# EAGLE schematic CMOSArray (EAGLE 9.3.2)
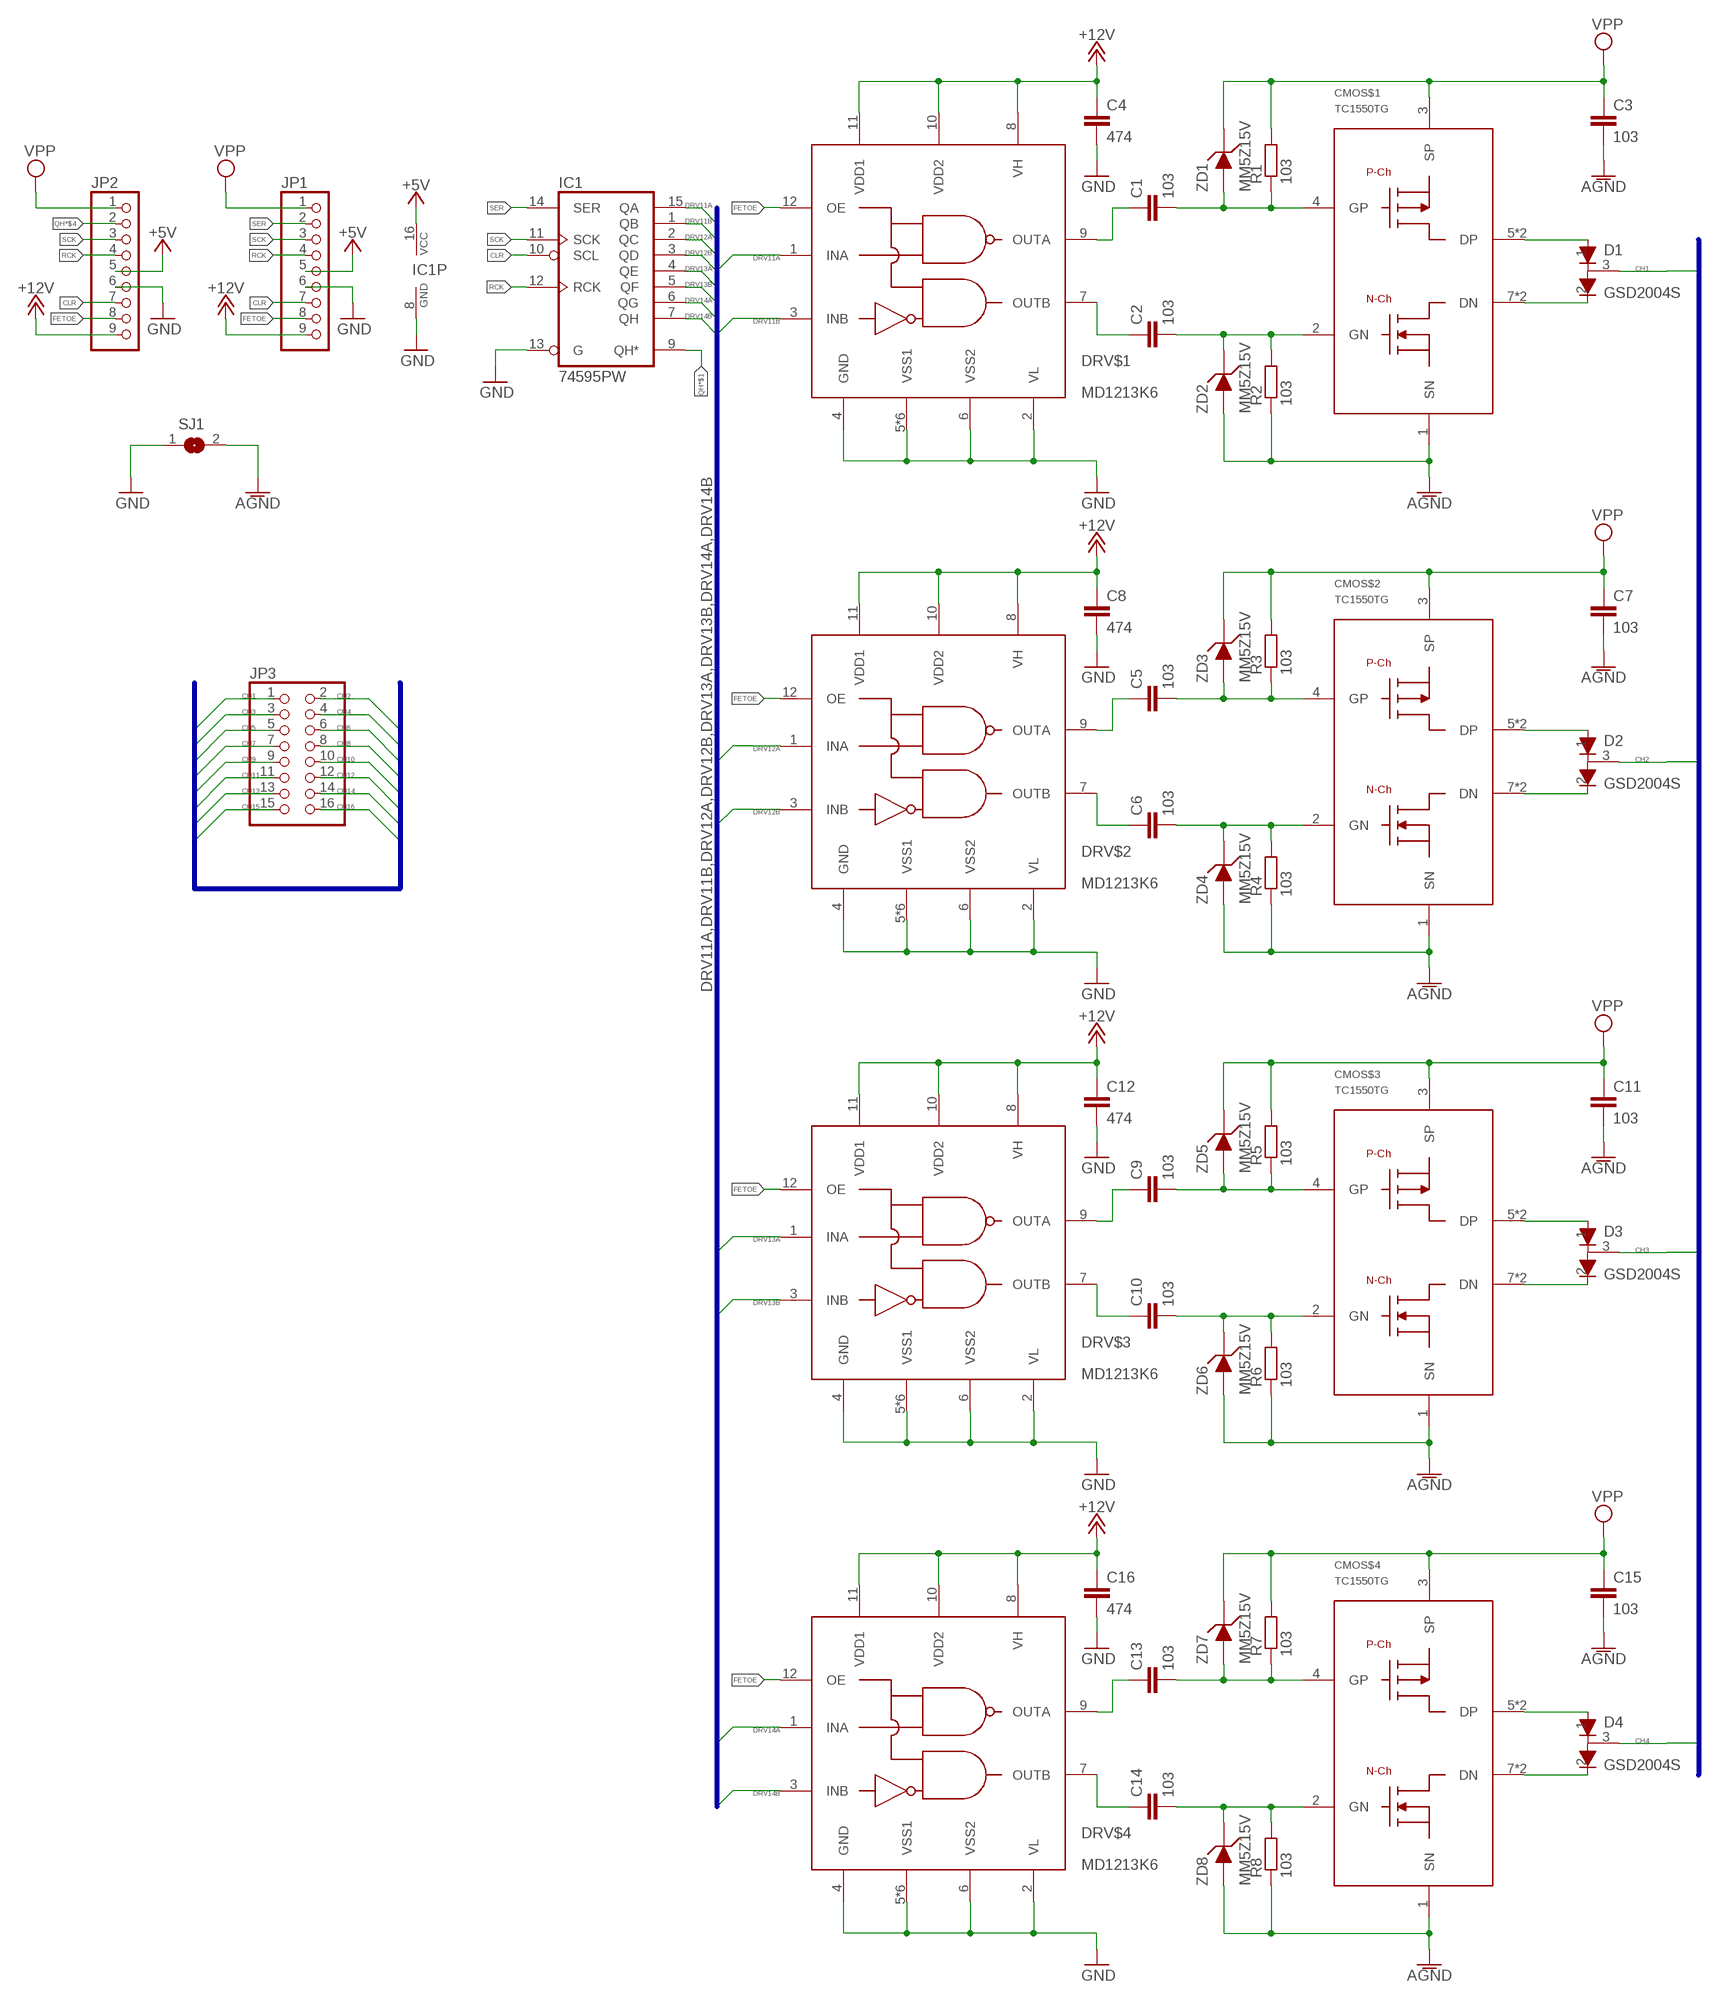
[diagram p0: schematic, sheet 1, part 1 of 3]
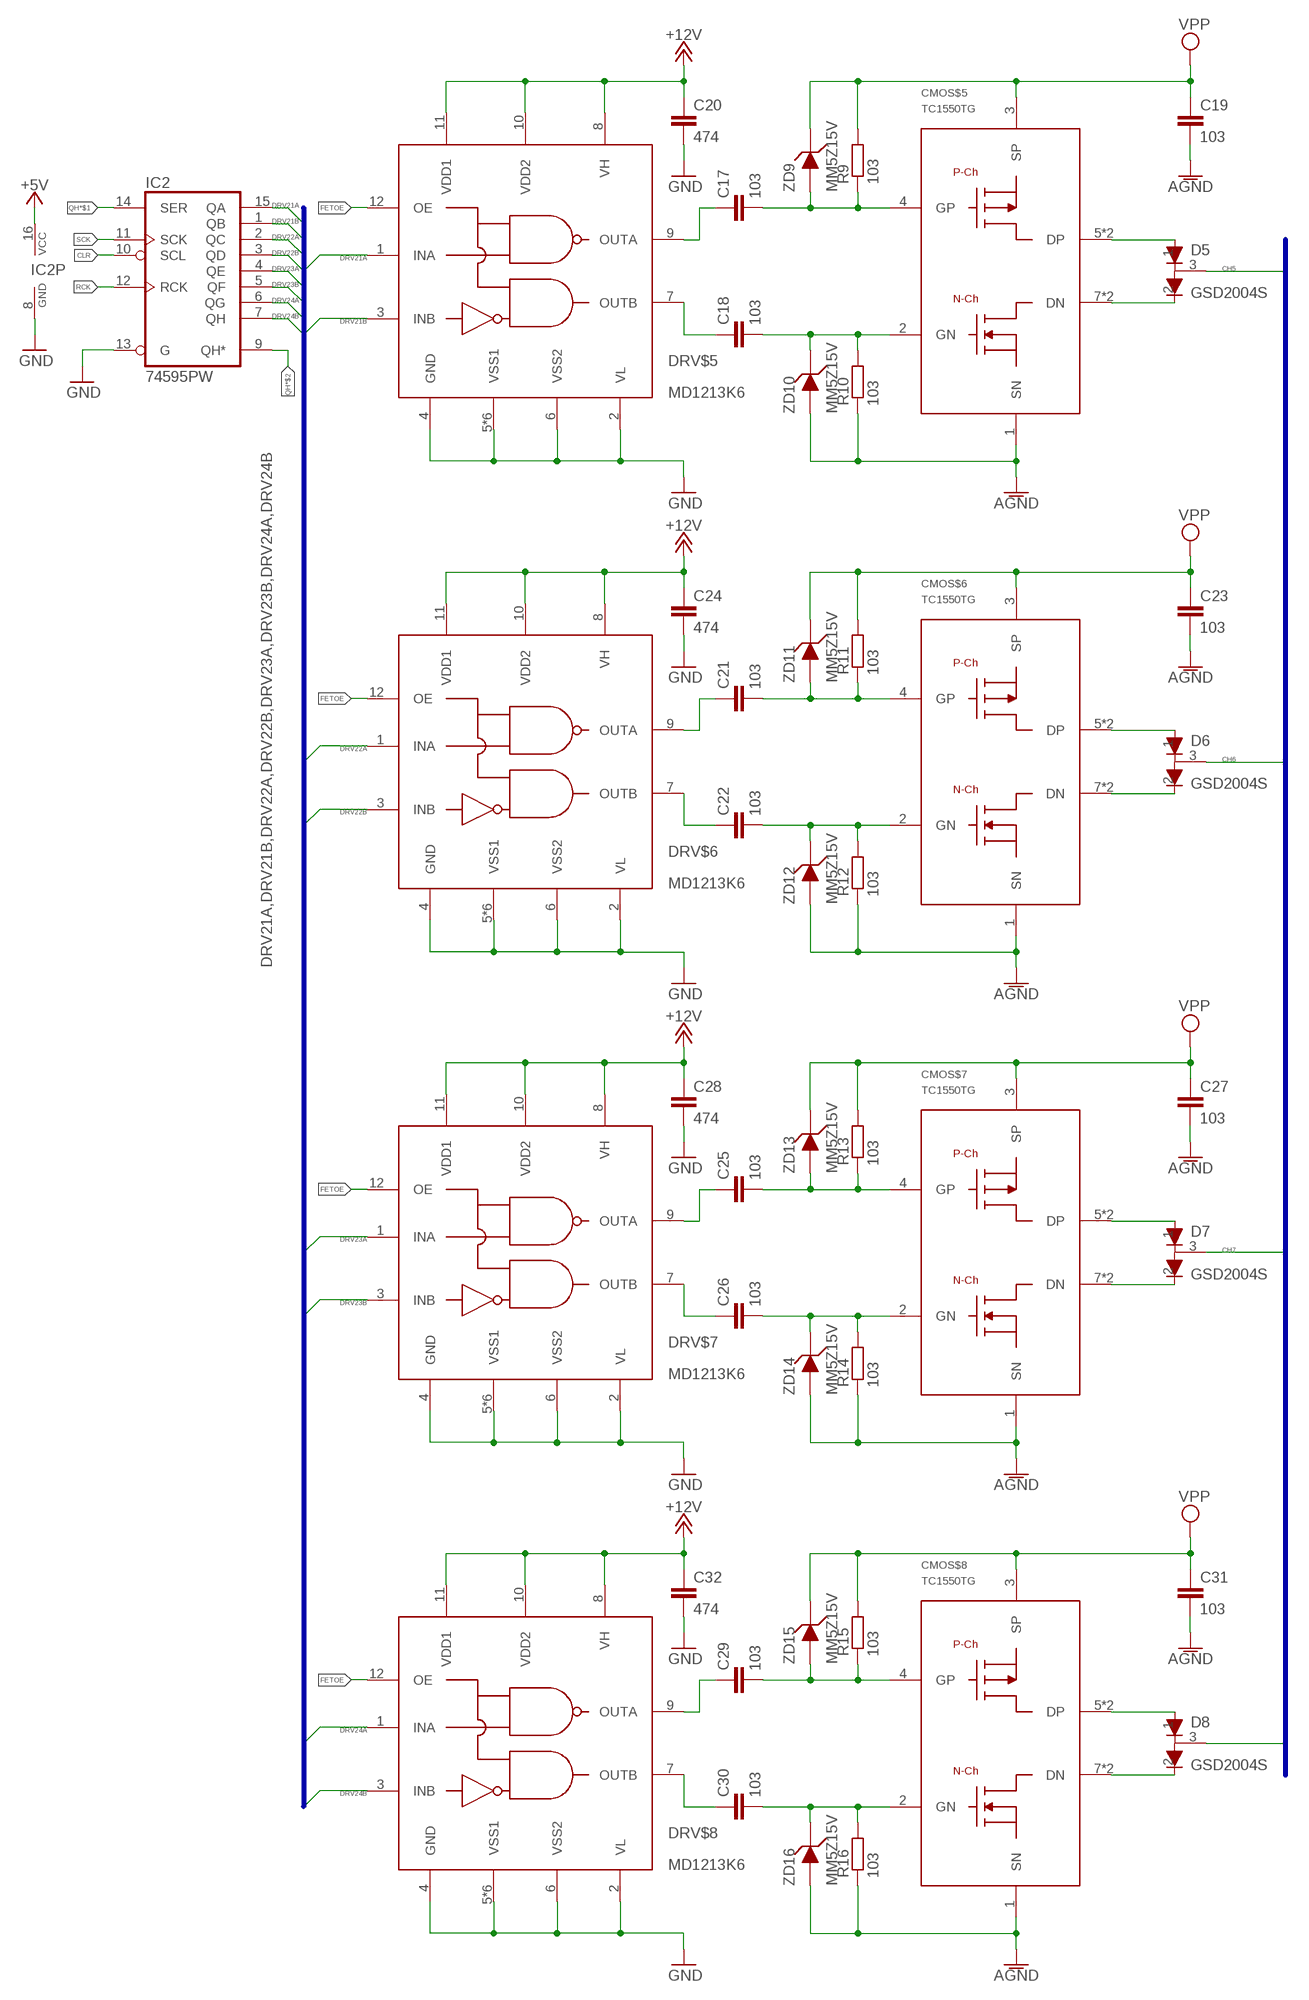
[diagram p1: schematic, sheet 1, part 2 of 3]
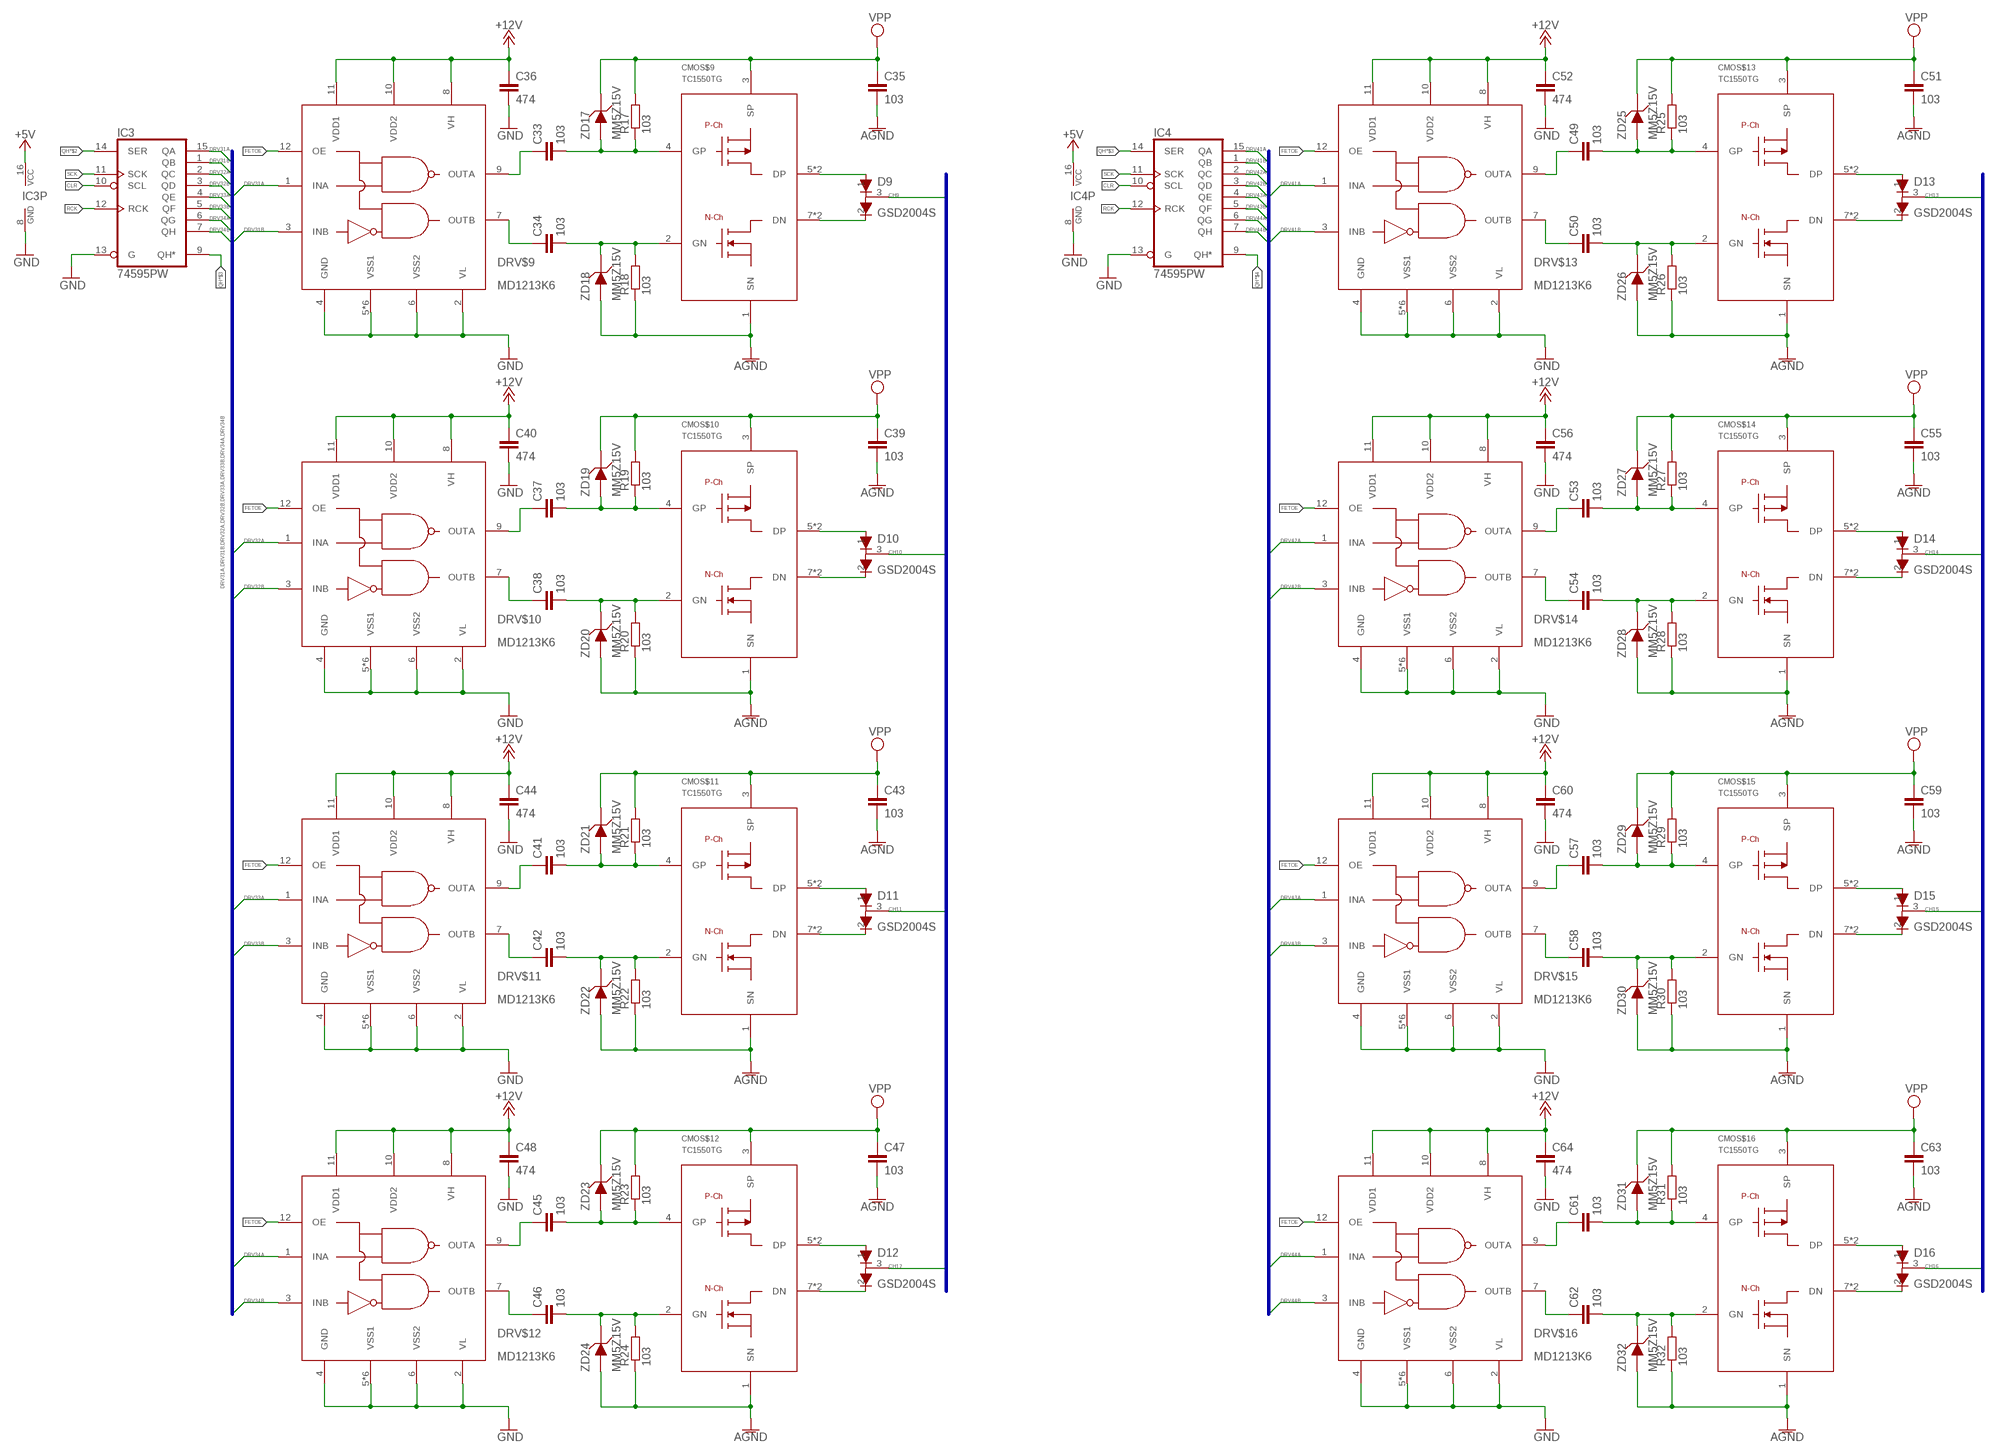
[diagram p2: schematic, sheet 1, part 3 of 3]

## Parts
C1  103  C-EUC3216  [C3216]
C2  103  C-EUC3216  [C3216]
C3  103  C-EUC3216  [C3216]
C4  474  C-EUC0402  [C0402]
C5  103  C-EUC3216  [C3216]
C6  103  C-EUC3216  [C3216]
C7  103  C-EUC3216  [C3216]
C8  474  C-EUC0402  [C0402]
C9  103  C-EUC3216  [C3216]
C10  103  C-EUC3216  [C3216]
C11  103  C-EUC3216  [C3216]
C12  474  C-EUC0402  [C0402]
C13  103  C-EUC3216  [C3216]
C14  103  C-EUC3216  [C3216]
C15  103  C-EUC3216  [C3216]
C16  474  C-EUC0402  [C0402]
C17  103  C-EUC3216  [C3216]
C18  103  C-EUC3216  [C3216]
C19  103  C-EUC3216  [C3216]
C20  474  C-EUC0402  [C0402]
C21  103  C-EUC3216  [C3216]
C22  103  C-EUC3216  [C3216]
C23  103  C-EUC3216  [C3216]
C24  474  C-EUC0402  [C0402]
C25  103  C-EUC3216  [C3216]
C26  103  C-EUC3216  [C3216]
C27  103  C-EUC3216  [C3216]
C28  474  C-EUC0402  [C0402]
C29  103  C-EUC3216  [C3216]
C30  103  C-EUC3216  [C3216]
C31  103  C-EUC3216  [C3216]
C32  474  C-EUC0402  [C0402]
C33  103  C-EUC3216  [C3216]
C34  103  C-EUC3216  [C3216]
C35  103  C-EUC3216  [C3216]
C36  474  C-EUC0402  [C0402]
C37  103  C-EUC3216  [C3216]
C38  103  C-EUC3216  [C3216]
C39  103  C-EUC3216  [C3216]
C40  474  C-EUC0402  [C0402]
C41  103  C-EUC3216  [C3216]
C42  103  C-EUC3216  [C3216]
C43  103  C-EUC3216  [C3216]
C44  474  C-EUC0402  [C0402]
C45  103  C-EUC3216  [C3216]
C46  103  C-EUC3216  [C3216]
C47  103  C-EUC3216  [C3216]
C48  474  C-EUC0402  [C0402]
C49  103  C-EUC3216  [C3216]
C50  103  C-EUC3216  [C3216]
C51  103  C-EUC3216  [C3216]
C52  474  C-EUC0402  [C0402]
C53  103  C-EUC3216  [C3216]
C54  103  C-EUC3216  [C3216]
C55  103  C-EUC3216  [C3216]
C56  474  C-EUC0402  [C0402]
C57  103  C-EUC3216  [C3216]
C58  103  C-EUC3216  [C3216]
C59  103  C-EUC3216  [C3216]
C60  474  C-EUC0402  [C0402]
C61  103  C-EUC3216  [C3216]
C62  103  C-EUC3216  [C3216]
C63  103  C-EUC3216  [C3216]
C64  474  C-EUC0402  [C0402]
CMOS$1  TC1550TG  [SOIC-08LG]
CMOS$2  TC1550TG  [SOIC-08LG]
CMOS$3  TC1550TG  [SOIC-08LG]
CMOS$4  TC1550TG  [SOIC-08LG]
CMOS$5  TC1550TG  [SOIC-08LG]
CMOS$6  TC1550TG  [SOIC-08LG]
CMOS$7  TC1550TG  [SOIC-08LG]
CMOS$8  TC1550TG  [SOIC-08LG]
CMOS$9  TC1550TG  [SOIC-08LG]
CMOS$10  TC1550TG  [SOIC-08LG]
CMOS$11  TC1550TG  [SOIC-08LG]
CMOS$12  TC1550TG  [SOIC-08LG]
CMOS$13  TC1550TG  [SOIC-08LG]
CMOS$14  TC1550TG  [SOIC-08LG]
CMOS$15  TC1550TG  [SOIC-08LG]
CMOS$16  TC1550TG  [SOIC-08LG]
D1  GSD2004S  [SOT23]
D2  GSD2004S  [SOT23]
D3  GSD2004S  [SOT23]
D4  GSD2004S  [SOT23]
D5  GSD2004S  [SOT23]
D6  GSD2004S  [SOT23]
D7  GSD2004S  [SOT23]
D8  GSD2004S  [SOT23]
D9  GSD2004S  [SOT23]
D10  GSD2004S  [SOT23]
D11  GSD2004S  [SOT23]
D12  GSD2004S  [SOT23]
D13  GSD2004S  [SOT23]
D14  GSD2004S  [SOT23]
D15  GSD2004S  [SOT23]
D16  GSD2004S  [SOT23]
DRV$1  MD1213K6  [QFN12]
DRV$2  MD1213K6  [QFN12]
DRV$3  MD1213K6  [QFN12]
DRV$4  MD1213K6  [QFN12]
DRV$5  MD1213K6  [QFN12]
DRV$6  MD1213K6  [QFN12]
DRV$7  MD1213K6  [QFN12]
DRV$8  MD1213K6  [QFN12]
DRV$9  MD1213K6  [QFN12]
DRV$10  MD1213K6  [QFN12]
DRV$11  MD1213K6  [QFN12]
DRV$12  MD1213K6  [QFN12]
DRV$13  MD1213K6  [QFN12]
DRV$14  MD1213K6  [QFN12]
DRV$15  MD1213K6  [QFN12]
DRV$16  MD1213K6  [QFN12]
IC1  74595PW  [TTSOP16]
IC2  74595PW  [TTSOP16]
IC3  74595PW  [TTSOP16]
IC4  74595PW  [TTSOP16]
JP1  PINHD-1X9  [1X09]
JP2  PINHD-1X9  [1X09]
JP3  PINHD-2X8  [2X08]
R1  103  R-EU_R0402  [R0402]
R2  103  R-EU_R0402  [R0402]
R3  103  R-EU_R0402  [R0402]
R4  103  R-EU_R0402  [R0402]
R5  103  R-EU_R0402  [R0402]
R6  103  R-EU_R0402  [R0402]
R7  103  R-EU_R0402  [R0402]
R8  103  R-EU_R0402  [R0402]
R9  103  R-EU_R0402  [R0402]
R10  103  R-EU_R0402  [R0402]
R11  103  R-EU_R0402  [R0402]
R12  103  R-EU_R0402  [R0402]
R13  103  R-EU_R0402  [R0402]
R14  103  R-EU_R0402  [R0402]
R15  103  R-EU_R0402  [R0402]
R16  103  R-EU_R0402  [R0402]
R17  103  R-EU_R0402  [R0402]
R18  103  R-EU_R0402  [R0402]
R19  103  R-EU_R0402  [R0402]
R20  103  R-EU_R0402  [R0402]
R21  103  R-EU_R0402  [R0402]
R22  103  R-EU_R0402  [R0402]
R23  103  R-EU_R0402  [R0402]
R24  103  R-EU_R0402  [R0402]
R25  103  R-EU_R0402  [R0402]
R26  103  R-EU_R0402  [R0402]
R27  103  R-EU_R0402  [R0402]
R28  103  R-EU_R0402  [R0402]
R29  103  R-EU_R0402  [R0402]
R30  103  R-EU_R0402  [R0402]
R31  103  R-EU_R0402  [R0402]
R32  103  R-EU_R0402  [R0402]
SJ1  SJ  [SJ]
ZD1  MM5Z15V  [SOD523]
ZD2  MM5Z15V  [SOD523]
ZD3  MM5Z15V  [SOD523]
ZD4  MM5Z15V  [SOD523]
ZD5  MM5Z15V  [SOD523]
ZD6  MM5Z15V  [SOD523]
ZD7  MM5Z15V  [SOD523]
ZD8  MM5Z15V  [SOD523]
ZD9  MM5Z15V  [SOD523]
ZD10  MM5Z15V  [SOD523]
ZD11  MM5Z15V  [SOD523]
ZD12  MM5Z15V  [SOD523]
ZD13  MM5Z15V  [SOD523]
ZD14  MM5Z15V  [SOD523]
ZD15  MM5Z15V  [SOD523]
ZD16  MM5Z15V  [SOD523]
ZD17  MM5Z15V  [SOD523]
ZD18  MM5Z15V  [SOD523]
ZD19  MM5Z15V  [SOD523]
ZD20  MM5Z15V  [SOD523]
ZD21  MM5Z15V  [SOD523]
ZD22  MM5Z15V  [SOD523]
ZD23  MM5Z15V  [SOD523]
ZD24  MM5Z15V  [SOD523]
ZD25  MM5Z15V  [SOD523]
ZD26  MM5Z15V  [SOD523]
ZD27  MM5Z15V  [SOD523]
ZD28  MM5Z15V  [SOD523]
ZD29  MM5Z15V  [SOD523]
ZD30  MM5Z15V  [SOD523]
ZD31  MM5Z15V  [SOD523]
ZD32  MM5Z15V  [SOD523]

## Nets
+5V: IC1.16(VCC) IC2.16(VCC) IC3.16(VCC) IC4.16(VCC) JP1.5 JP2.5
+12V: C4.1 C8.1 C12.1 C16.1 C20.1 C24.1 C28.1 C32.1 C36.1 C40.1 C44.1 C48.1 C52.1 C56.1 C60.1 C64.1 DRV$1.8(VH) DRV$1.10(VDD2) DRV$1.11(VDD1) DRV$2.8(VH) DRV$2.10(VDD2) DRV$2.11(VDD1) DRV$3.8(VH) DRV$3.10(VDD2) DRV$3.11(VDD1) DRV$4.8(VH) DRV$4.10(VDD2) DRV$4.11(VDD1) DRV$5.8(VH) DRV$5.10(VDD2) DRV$5.11(VDD1) DRV$6.8(VH) DRV$6.10(VDD2) DRV$6.11(VDD1) DRV$7.8(VH) DRV$7.10(VDD2) DRV$7.11(VDD1) DRV$8.8(VH) DRV$8.10(VDD2) DRV$8.11(VDD1) DRV$9.8(VH) DRV$9.10(VDD2) DRV$9.11(VDD1) DRV$10.8(VH) DRV$10.10(VDD2) DRV$10.11(VDD1) DRV$11.8(VH) DRV$11.10(VDD2) DRV$11.11(VDD1) DRV$12.8(VH) DRV$12.10(VDD2) DRV$12.11(VDD1) DRV$13.8(VH) DRV$13.10(VDD2) DRV$13.11(VDD1) DRV$14.8(VH) DRV$14.10(VDD2) DRV$14.11(VDD1) DRV$15.8(VH) DRV$15.10(VDD2) DRV$15.11(VDD1) DRV$16.8(VH) DRV$16.10(VDD2) DRV$16.11(VDD1) JP1.9 JP2.9
AGND: C3.2 C7.2 C11.2 C15.2 C19.2 C23.2 C27.2 C31.2 C35.2 C39.2 C43.2 C47.2 C51.2 C55.2 C59.2 C63.2 CMOS$1.1(SN) CMOS$2.1(SN) CMOS$3.1(SN) CMOS$4.1(SN) CMOS$5.1(SN) CMOS$6.1(SN) CMOS$7.1(SN) CMOS$8.1(SN) CMOS$9.1(SN) CMOS$10.1(SN) CMOS$11.1(SN) CMOS$12.1(SN) CMOS$13.1(SN) CMOS$14.1(SN) CMOS$15.1(SN) CMOS$16.1(SN) R2.1 R4.1 R6.1 R8.1 R10.1 R12.1 R14.1 R16.1 R18.1 R20.1 R22.1 R24.1 R26.1 R28.1 R30.1 R32.1 SJ1.2 ZD2.P$2 ZD4.P$2 ZD6.P$2 ZD8.P$2 ZD10.P$2 ZD12.P$2 ZD14.P$2 ZD16.P$2 ZD18.P$2 ZD20.P$2 ZD22.P$2 ZD24.P$2 ZD26.P$2 ZD28.P$2 ZD30.P$2 ZD32.P$2
CH1: D1.3 JP3.1
CH2: D2.3 JP3.2
CH3: D3.3 JP3.3
CH4: D4.3 JP3.4
CH5: D5.3 JP3.5
CH6: D6.3 JP3.6
CH7: D7.3 JP3.7
CH8: D8.3 JP3.8
CH9: D9.3 JP3.9
CH10: D10.3 JP3.10
CH11: D11.3 JP3.11
CH12: D12.3 JP3.12
CH13: D13.3 JP3.13
CH14: D14.3 JP3.14
CH15: D15.3 JP3.15
CH16: D16.3 JP3.16
CLR: IC1.10(SCL) IC2.10(SCL) IC3.10(SCL) IC4.10(SCL) JP1.7 JP2.7
DRV11A: DRV$1.1(INA) IC1.15(QA)
DRV11B: DRV$1.3(INB) IC1.1(QB)
DRV12A: DRV$2.1(INA) IC1.2(QC)
DRV12B: DRV$2.3(INB) IC1.3(QD)
DRV13A: DRV$3.1(INA) IC1.4(QE)
DRV13B: DRV$3.3(INB) IC1.5(QF)
DRV14A: DRV$4.1(INA) IC1.6(QG)
DRV14B: DRV$4.3(INB) IC1.7(QH)
DRV21A: DRV$5.1(INA) IC2.15(QA)
DRV21B: DRV$5.3(INB) IC2.1(QB)
DRV22A: DRV$6.1(INA) IC2.2(QC)
DRV22B: DRV$6.3(INB) IC2.3(QD)
DRV23A: DRV$7.1(INA) IC2.4(QE)
DRV23B: DRV$7.3(INB) IC2.5(QF)
DRV24A: DRV$8.1(INA) IC2.6(QG)
DRV24B: DRV$8.3(INB) IC2.7(QH)
DRV31A: DRV$9.1(INA) IC3.15(QA)
DRV31B: DRV$9.3(INB) IC3.1(QB)
DRV32A: DRV$10.1(INA) IC3.2(QC)
DRV32B: DRV$10.3(INB) IC3.3(QD)
DRV33A: DRV$11.1(INA) IC3.4(QE)
DRV33B: DRV$11.3(INB) IC3.5(QF)
DRV34A: DRV$12.1(INA) IC3.6(QG)
DRV34B: DRV$12.3(INB) IC3.7(QH)
DRV41A: DRV$13.1(INA) IC4.15(QA)
DRV41B: DRV$13.3(INB) IC4.1(QB)
DRV42A: DRV$14.1(INA) IC4.2(QC)
DRV42B: DRV$14.3(INB) IC4.3(QD)
DRV43A: DRV$15.1(INA) IC4.4(QE)
DRV43B: DRV$15.3(INB) IC4.5(QF)
DRV44A: DRV$16.1(INA) IC4.6(QG)
DRV44B: DRV$16.3(INB) IC4.7(QH)
FETOE: DRV$1.12(OE) DRV$2.12(OE) DRV$3.12(OE) DRV$4.12(OE) DRV$5.12(OE) DRV$6.12(OE) DRV$7.12(OE) DRV$8.12(OE) DRV$9.12(OE) DRV$10.12(OE) DRV$11.12(OE) DRV$12.12(OE) DRV$13.12(OE) DRV$14.12(OE) DRV$15.12(OE) DRV$16.12(OE) JP1.8 JP2.8
GND: C4.2 C8.2 C12.2 C16.2 C20.2 C24.2 C28.2 C32.2 C36.2 C40.2 C44.2 C48.2 C52.2 C56.2 C60.2 C64.2 DRV$1.2(VL) DRV$1.4(GND) DRV$1.5(VSS1) DRV$1.6(VSS2) DRV$1.THP(VSS1) DRV$1.THV$1(VSS1) DRV$1.THV$2(VSS1) DRV$1.THV$3(VSS1) DRV$1.THV$4(VSS1) DRV$2.2(VL) DRV$2.4(GND) DRV$2.5(VSS1) DRV$2.6(VSS2) DRV$2.THP(VSS1) DRV$2.THV$1(VSS1) DRV$2.THV$2(VSS1) DRV$2.THV$3(VSS1) DRV$2.THV$4(VSS1) DRV$3.2(VL) DRV$3.4(GND) DRV$3.5(VSS1) DRV$3.6(VSS2) DRV$3.THP(VSS1) DRV$3.THV$1(VSS1) DRV$3.THV$2(VSS1) DRV$3.THV$3(VSS1) DRV$3.THV$4(VSS1) DRV$4.2(VL) DRV$4.4(GND) DRV$4.5(VSS1) DRV$4.6(VSS2) DRV$4.THP(VSS1) DRV$4.THV$1(VSS1) DRV$4.THV$2(VSS1) DRV$4.THV$3(VSS1) DRV$4.THV$4(VSS1) DRV$5.2(VL) DRV$5.4(GND) DRV$5.5(VSS1) DRV$5.6(VSS2) DRV$5.THP(VSS1) DRV$5.THV$1(VSS1) DRV$5.THV$2(VSS1) DRV$5.THV$3(VSS1) DRV$5.THV$4(VSS1) DRV$6.2(VL) DRV$6.4(GND) DRV$6.5(VSS1) DRV$6.6(VSS2) DRV$6.THP(VSS1) DRV$6.THV$1(VSS1) DRV$6.THV$2(VSS1) DRV$6.THV$3(VSS1) DRV$6.THV$4(VSS1) DRV$7.2(VL) DRV$7.4(GND) DRV$7.5(VSS1) DRV$7.6(VSS2) DRV$7.THP(VSS1) DRV$7.THV$1(VSS1) DRV$7.THV$2(VSS1) DRV$7.THV$3(VSS1) DRV$7.THV$4(VSS1) DRV$8.2(VL) DRV$8.4(GND) DRV$8.5(VSS1) DRV$8.6(VSS2) DRV$8.THP(VSS1) DRV$8.THV$1(VSS1) DRV$8.THV$2(VSS1) DRV$8.THV$3(VSS1) DRV$8.THV$4(VSS1) DRV$9.2(VL) DRV$9.4(GND) DRV$9.5(VSS1) DRV$9.6(VSS2) DRV$9.THP(VSS1) DRV$9.THV$1(VSS1) DRV$9.THV$2(VSS1) DRV$9.THV$3(VSS1) DRV$9.THV$4(VSS1) DRV$10.2(VL) DRV$10.4(GND) DRV$10.5(VSS1) DRV$10.6(VSS2) DRV$10.THP(VSS1) DRV$10.THV$1(VSS1) DRV$10.THV$2(VSS1) DRV$10.THV$3(VSS1) DRV$10.THV$4(VSS1) DRV$11.2(VL) DRV$11.4(GND) DRV$11.5(VSS1) DRV$11.6(VSS2) DRV$11.THP(VSS1) DRV$11.THV$1(VSS1) DRV$11.THV$2(VSS1) DRV$11.THV$3(VSS1) DRV$11.THV$4(VSS1) DRV$12.2(VL) DRV$12.4(GND) DRV$12.5(VSS1) DRV$12.6(VSS2) DRV$12.THP(VSS1) DRV$12.THV$1(VSS1) DRV$12.THV$2(VSS1) DRV$12.THV$3(VSS1) DRV$12.THV$4(VSS1) DRV$13.2(VL) DRV$13.4(GND) DRV$13.5(VSS1) DRV$13.6(VSS2) DRV$13.THP(VSS1) DRV$13.THV$1(VSS1) DRV$13.THV$2(VSS1) DRV$13.THV$3(VSS1) DRV$13.THV$4(VSS1) DRV$14.2(VL) DRV$14.4(GND) DRV$14.5(VSS1) DRV$14.6(VSS2) DRV$14.THP(VSS1) DRV$14.THV$1(VSS1) DRV$14.THV$2(VSS1) DRV$14.THV$3(VSS1) DRV$14.THV$4(VSS1) DRV$15.2(VL) DRV$15.4(GND) DRV$15.5(VSS1) DRV$15.6(VSS2) DRV$15.THP(VSS1) DRV$15.THV$1(VSS1) DRV$15.THV$2(VSS1) DRV$15.THV$3(VSS1) DRV$15.THV$4(VSS1) DRV$16.2(VL) DRV$16.4(GND) DRV$16.5(VSS1) DRV$16.6(VSS2) DRV$16.THP(VSS1) DRV$16.THV$1(VSS1) DRV$16.THV$2(VSS1) DRV$16.THV$3(VSS1) DRV$16.THV$4(VSS1) IC1.8(GND) IC1.13(G) IC2.8(GND) IC2.13(G) IC3.8(GND) IC3.13(G) IC4.8(GND) IC4.13(G) JP1.6 JP2.6 SJ1.1
N$1: C1.1 DRV$1.9(OUTA)
N$2: C1.2 CMOS$1.4(GP) R1.1 ZD1.P$2
N$3: C2.1 DRV$1.7(OUTB)
N$4: C2.2 CMOS$1.2(GN) R2.2 ZD2.P$1(K)
N$5: C5.1 DRV$2.9(OUTA)
N$6: CMOS$1.5(DP) CMOS$1.6(DP) D1.1
N$7: CMOS$1.7(DN) CMOS$1.8(DN) D1.2
N$8: C5.2 CMOS$2.4(GP) R3.1 ZD3.P$2
N$9: C6.1 DRV$2.7(OUTB)
N$10: C6.2 CMOS$2.2(GN) R4.2 ZD4.P$1(K)
N$11: CMOS$2.5(DP) CMOS$2.6(DP) D2.1
N$12: CMOS$2.7(DN) CMOS$2.8(DN) D2.2
N$13: C9.1 DRV$3.9(OUTA)
N$14: C9.2 CMOS$3.4(GP) R5.1 ZD5.P$2
N$15: C10.1 DRV$3.7(OUTB)
N$16: C10.2 CMOS$3.2(GN) R6.2 ZD6.P$1(K)
N$17: CMOS$3.5(DP) CMOS$3.6(DP) D3.1
N$18: CMOS$3.7(DN) CMOS$3.8(DN) D3.2
N$19: C13.1 DRV$4.9(OUTA)
N$20: C13.2 CMOS$4.4(GP) R7.1 ZD7.P$2
N$21: C14.1 DRV$4.7(OUTB)
N$22: C14.2 CMOS$4.2(GN) R8.2 ZD8.P$1(K)
N$23: CMOS$4.5(DP) CMOS$4.6(DP) D4.1
N$24: CMOS$4.7(DN) CMOS$4.8(DN) D4.2
N$25: C17.1 DRV$5.9(OUTA)
N$26: C17.2 CMOS$5.4(GP) R9.1 ZD9.P$2
N$27: C18.1 DRV$5.7(OUTB)
N$28: C18.2 CMOS$5.2(GN) R10.2 ZD10.P$1(K)
N$29: CMOS$5.5(DP) CMOS$5.6(DP) D5.1
N$30: CMOS$5.7(DN) CMOS$5.8(DN) D5.2
N$31: C21.1 DRV$6.9(OUTA)
N$32: C21.2 CMOS$6.4(GP) R11.1 ZD11.P$2
N$33: C22.1 DRV$6.7(OUTB)
N$34: C22.2 CMOS$6.2(GN) R12.2 ZD12.P$1(K)
N$35: CMOS$6.5(DP) CMOS$6.6(DP) D6.1
N$36: CMOS$6.7(DN) CMOS$6.8(DN) D6.2
N$37: C25.1 DRV$7.9(OUTA)
N$38: C25.2 CMOS$7.4(GP) R13.1 ZD13.P$2
N$39: C26.1 DRV$7.7(OUTB)
N$40: C26.2 CMOS$7.2(GN) R14.2 ZD14.P$1(K)
N$41: CMOS$7.5(DP) CMOS$7.6(DP) D7.1
N$42: CMOS$7.7(DN) CMOS$7.8(DN) D7.2
N$43: C29.1 DRV$8.9(OUTA)
N$44: C29.2 CMOS$8.4(GP) R15.1 ZD15.P$2
N$45: C30.1 DRV$8.7(OUTB)
N$46: C30.2 CMOS$8.2(GN) R16.2 ZD16.P$1(K)
N$47: CMOS$8.5(DP) CMOS$8.6(DP) D8.1
N$48: CMOS$8.7(DN) CMOS$8.8(DN) D8.2
N$49: C33.1 DRV$9.9(OUTA)
N$50: C33.2 CMOS$9.4(GP) R17.1 ZD17.P$2
N$51: C34.1 DRV$9.7(OUTB)
N$52: C34.2 CMOS$9.2(GN) R18.2 ZD18.P$1(K)
N$53: CMOS$9.5(DP) CMOS$9.6(DP) D9.1
N$54: CMOS$9.7(DN) CMOS$9.8(DN) D9.2
N$55: C37.1 DRV$10.9(OUTA)
N$56: C37.2 CMOS$10.4(GP) R19.1 ZD19.P$2
N$57: C38.1 DRV$10.7(OUTB)
N$58: C38.2 CMOS$10.2(GN) R20.2 ZD20.P$1(K)
N$59: CMOS$10.5(DP) CMOS$10.6(DP) D10.1
N$60: CMOS$10.7(DN) CMOS$10.8(DN) D10.2
N$61: C41.1 DRV$11.9(OUTA)
N$62: C41.2 CMOS$11.4(GP) R21.1 ZD21.P$2
N$63: C42.1 DRV$11.7(OUTB)
N$64: C42.2 CMOS$11.2(GN) R22.2 ZD22.P$1(K)
N$65: CMOS$11.5(DP) CMOS$11.6(DP) D11.1
N$66: CMOS$11.7(DN) CMOS$11.8(DN) D11.2
N$67: C45.1 DRV$12.9(OUTA)
N$68: C45.2 CMOS$12.4(GP) R23.1 ZD23.P$2
N$69: C46.1 DRV$12.7(OUTB)
N$70: C46.2 CMOS$12.2(GN) R24.2 ZD24.P$1(K)
N$71: CMOS$12.5(DP) CMOS$12.6(DP) D12.1
N$72: CMOS$12.7(DN) CMOS$12.8(DN) D12.2
N$73: C49.1 DRV$13.9(OUTA)
N$74: C49.2 CMOS$13.4(GP) R25.1 ZD25.P$2
N$75: C50.1 DRV$13.7(OUTB)
N$76: C50.2 CMOS$13.2(GN) R26.2 ZD26.P$1(K)
N$77: CMOS$13.5(DP) CMOS$13.6(DP) D13.1
N$78: CMOS$13.7(DN) CMOS$13.8(DN) D13.2
N$79: C53.1 DRV$14.9(OUTA)
N$80: C53.2 CMOS$14.4(GP) R27.1 ZD27.P$2
N$81: C54.1 DRV$14.7(OUTB)
N$82: C54.2 CMOS$14.2(GN) R28.2 ZD28.P$1(K)
N$83: CMOS$14.5(DP) CMOS$14.6(DP) D14.1
N$84: CMOS$14.7(DN) CMOS$14.8(DN) D14.2
N$85: C57.1 DRV$15.9(OUTA)
N$86: C57.2 CMOS$15.4(GP) R29.1 ZD29.P$2
N$87: C58.1 DRV$15.7(OUTB)
N$88: C58.2 CMOS$15.2(GN) R30.2 ZD30.P$1(K)
N$89: CMOS$15.5(DP) CMOS$15.6(DP) D15.1
N$90: CMOS$15.7(DN) CMOS$15.8(DN) D15.2
N$91: C61.1 DRV$16.9(OUTA)
N$92: C61.2 CMOS$16.4(GP) R31.1 ZD31.P$2
N$93: C62.1 DRV$16.7(OUTB)
N$94: C62.2 CMOS$16.2(GN) R32.2 ZD32.P$1(K)
N$95: CMOS$16.5(DP) CMOS$16.6(DP) D16.1
N$96: CMOS$16.7(DN) CMOS$16.8(DN) D16.2
QH*$1: IC1.9(QH*) IC2.14(SER)
QH*$2: IC2.9(QH*) IC3.14(SER)
QH*$3: IC3.9(QH*) IC4.14(SER)
QH*$4: IC4.9(QH*) JP2.2
RCK: IC1.12(RCK) IC2.12(RCK) IC3.12(RCK) IC4.12(RCK) JP1.4 JP2.4
SCK: IC1.11(SCK) IC2.11(SCK) IC3.11(SCK) IC4.11(SCK) JP1.3 JP2.3
SER: IC1.14(SER) JP1.2
VPP: C3.1 C7.1 C11.1 C15.1 C19.1 C23.1 C27.1 C31.1 C35.1 C39.1 C43.1 C47.1 C51.1 C55.1 C59.1 C63.1 CMOS$1.3(SP) CMOS$2.3(SP) CMOS$3.3(SP) CMOS$4.3(SP) CMOS$5.3(SP) CMOS$6.3(SP) CMOS$7.3(SP) CMOS$8.3(SP) CMOS$9.3(SP) CMOS$10.3(SP) CMOS$11.3(SP) CMOS$12.3(SP) CMOS$13.3(SP) CMOS$14.3(SP) CMOS$15.3(SP) CMOS$16.3(SP) JP1.1 JP2.1 R1.2 R3.2 R5.2 R7.2 R9.2 R11.2 R13.2 R15.2 R17.2 R19.2 R21.2 R23.2 R25.2 R27.2 R29.2 R31.2 ZD1.P$1(K) ZD3.P$1(K) ZD5.P$1(K) ZD7.P$1(K) ZD9.P$1(K) ZD11.P$1(K) ZD13.P$1(K) ZD15.P$1(K) ZD17.P$1(K) ZD19.P$1(K) ZD21.P$1(K) ZD23.P$1(K) ZD25.P$1(K) ZD27.P$1(K) ZD29.P$1(K) ZD31.P$1(K)

## Buses
DRV41A,DRV41B,DRV42A,DRV42B,DRV43A,DRV43B,DRV44A,DRV44B
CH1,CH2,CH3,CH4,CH5,CH6,CH7,CH8,CH9,CH10,CH11,CH12,CH13,CH14,CH15,CH16
CH1,CH2,CH3,CH4
CH5,CH6,CH7,CH8
CH9,CH10,CH11,CH12
CH13,CH14,CH15,CH16
DRV21A,DRV21B,DRV22A,DRV22B,DRV23A,DRV23B,DRV24A,DRV24B
DRV11A,DRV11B,DRV12A,DRV12B,DRV13A,DRV13B,DRV14A,DRV14B
DRV31A,DRV31B,DRV32A,DRV32B,DRV33A,DRV33B,DRV34A,DRV34B

## Library data of the parts
C1-C64 = rcl:C-EU: CAPACITOR, European symbol; SPICEPREFIX: C
CMOS$1-CMOS$16 = TC1550:TC1550TG: TC1550TG N- and P-Channel Enhancement-Mode Dual MOSFET 8-lead soic (TG) package
D1-D16 = Diode_Vishay:GSD2004S: GSD2004S http://www.vishay.com/docs/85728/gsd2004s.pdf
DRV$1-DRV$16 = md1213:MD1213K6: MD1213K6 One of Supertex (Microchip Tech.) devices. 12-lead package (K6) The thermal pad and vias are connected to VSS1 externally in this library. VSS1 and VSS2 should be at the same potential. VDD1 and VDD2 should also be at the same potential.
IC1-IC4 = 74xx-eu:74*595: 8-bit SHIFT REGISTER, output latch
JP1 JP2 = pinhead:PINHD-1X9: PIN HEADER
JP3 = pinhead:PINHD-2X8: PIN HEADER
R1-R32 = rcl:R-EU_: RESISTOR, European symbol; SPICEPREFIX: R
SJ1 = jumper:SJ: SMD solder JUMPER
ZD1-ZD32 = fairchild-semic:MM5Z15V